# Altium schematic sheet 7М07110 Э3.SchDoc
size 420 x 297 mm; DocumentNumber: 1; SheetNumber: 1; SheetTotal: 11; ListNumber: 1
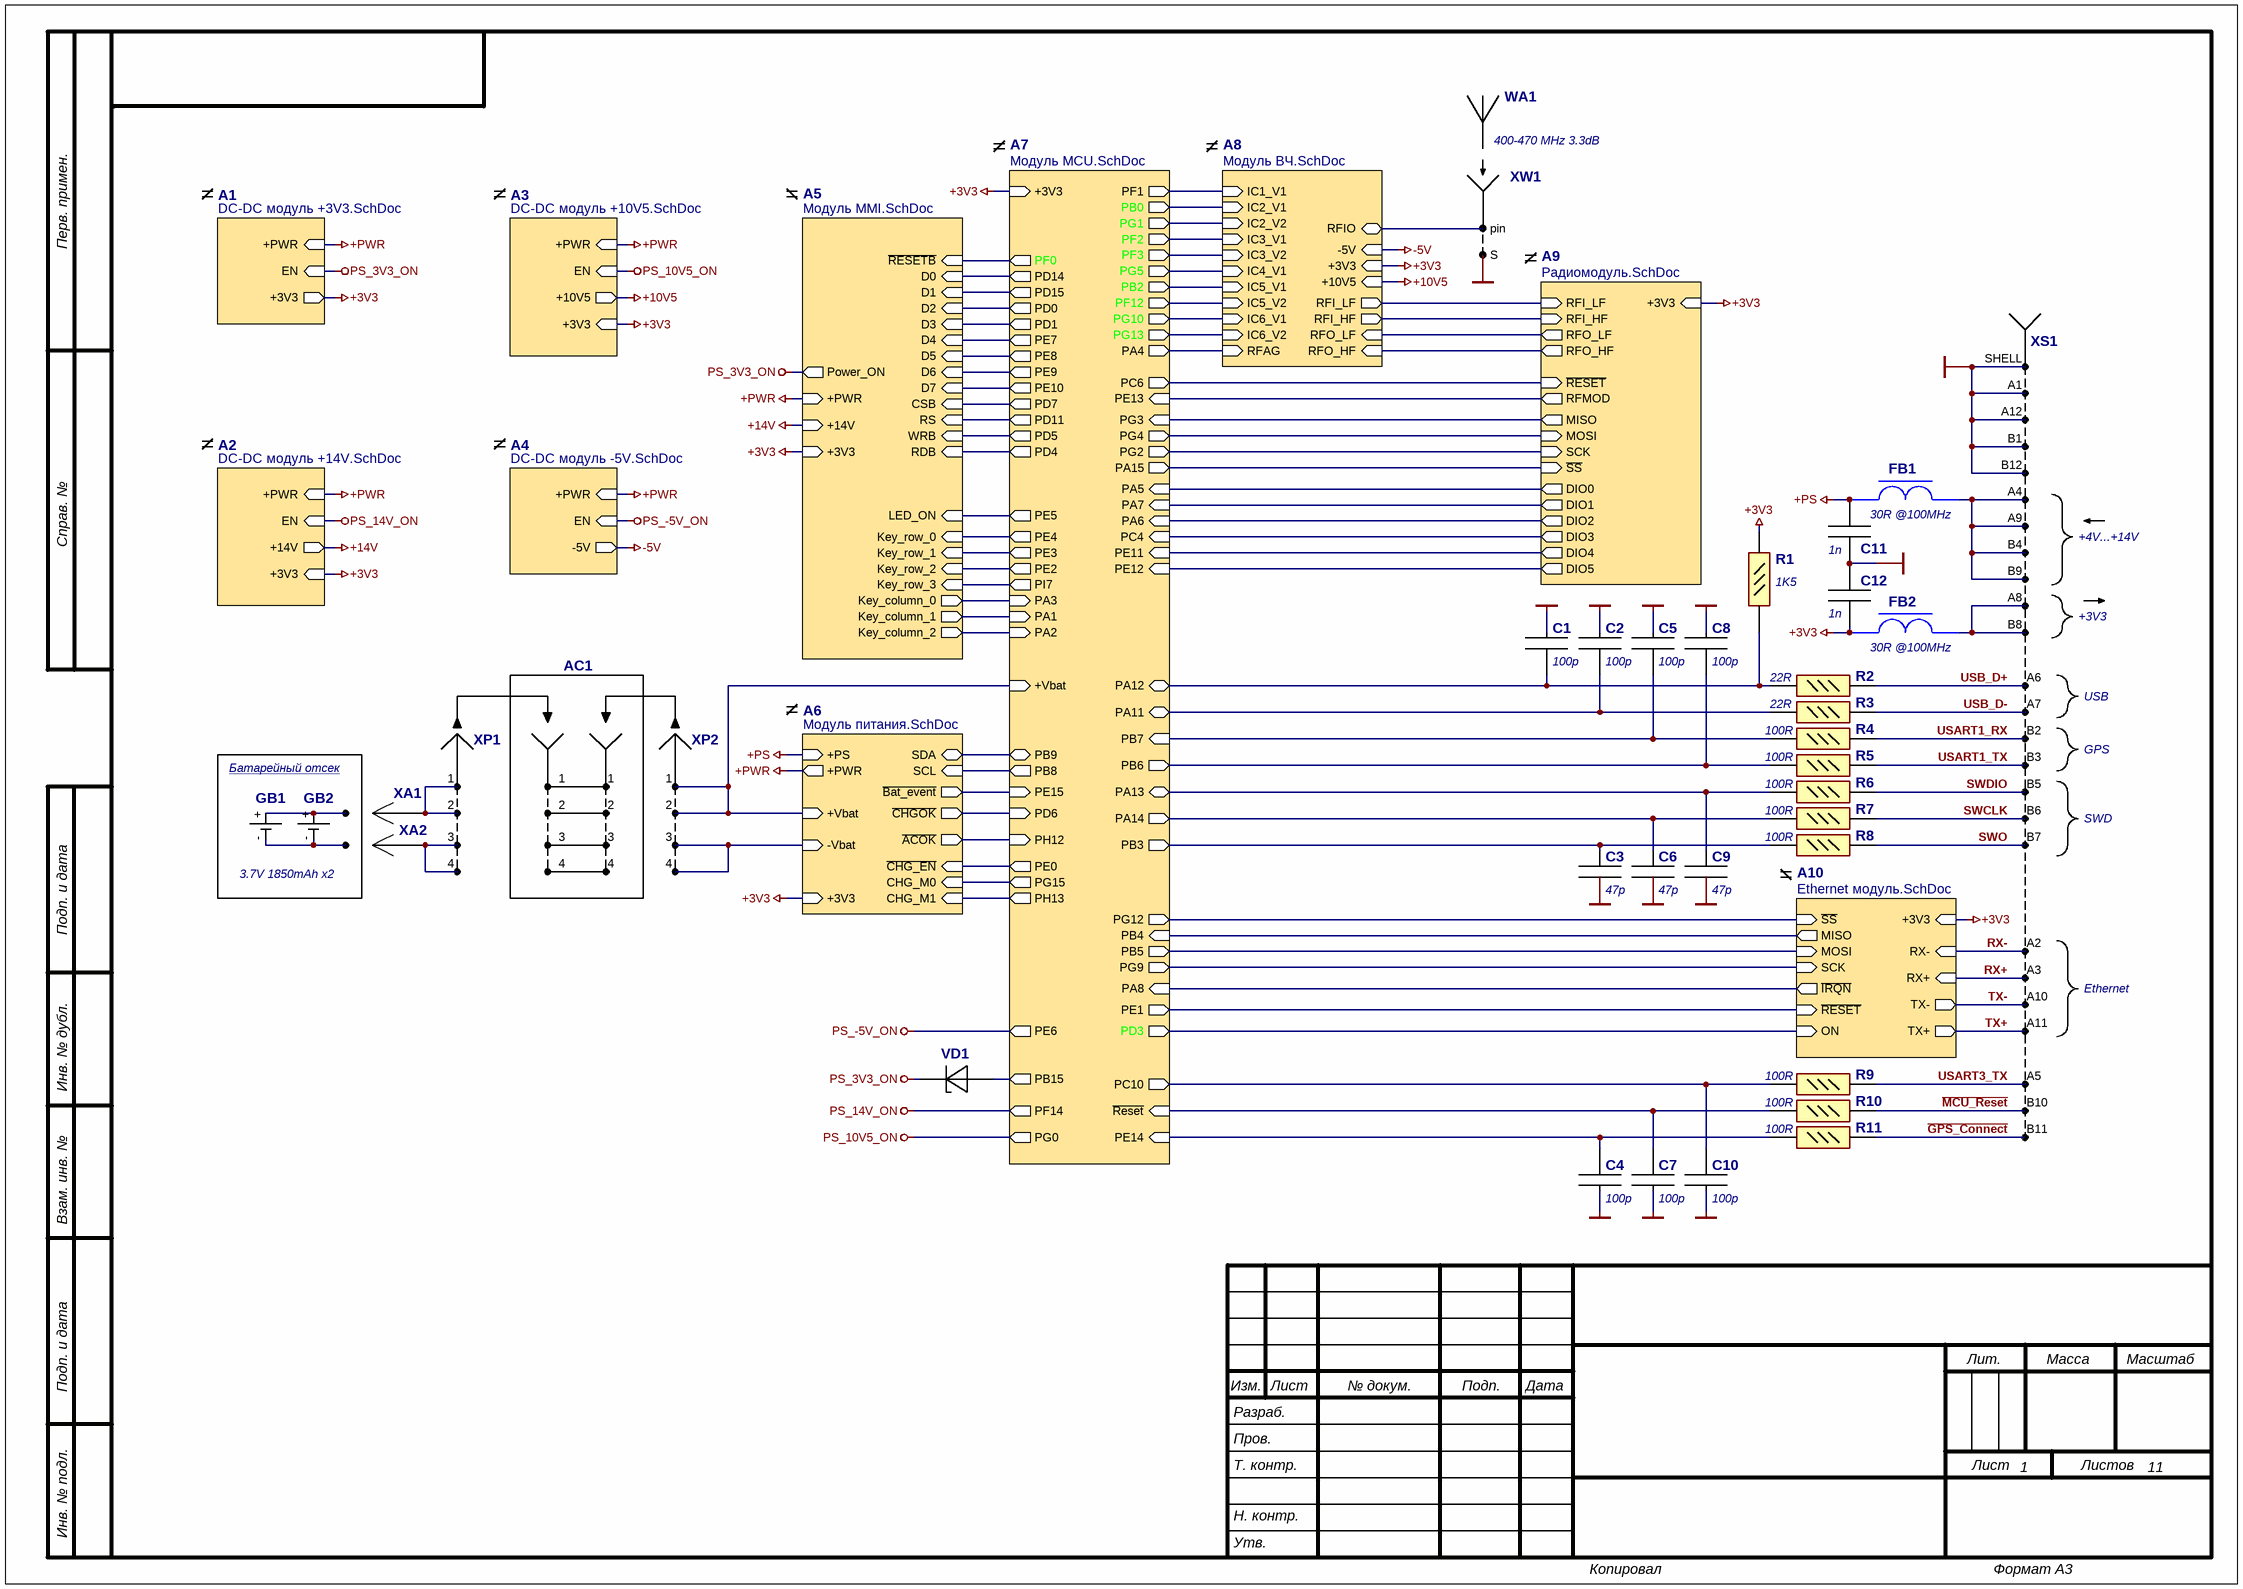
[diagram p0: 7М07110 Э3.SchDoc]

## Parts
AC1  0151320401  (value not drawn)
C1  100p  [:CAP0402 100x50x50]
C2  100p  [:CAP0402 100x50x50]
C3  47p  [:CAP0402 100x50x50]
C4  100p  [:CAP0402 100x50x50]
C5  100p  [:CAP0402 100x50x50]
C6  47p  [:CAP0402 100x50x50]
C7  100p  [:CAP0402 100x50x50]
C8  100p  [:CAP0402 100x50x50]
C9  47p  [:CAP0402 100x50x50]
C10  100p  [:CAP0402 100x50x50]
C11  1n  [:CAP0402 100x50x50]
C12  1n  [:CAP0402 100x50x50]
FB1  30R @100MHz  [:FER BLM18SP300SN1D]
FB2  30R @100MHz  [:FER BLM18SP300SN1D]
GB1  3.7V 1850mAh  (value not drawn)
GB2  3.7V 1850mAh  (value not drawn)
R1  Manufacturer_Part_Number (part 2: value): 1K5  [:RES0402]  (hidden comment: RC0402FR-07)
R2  Manufacturer_Part_Number (part 2: value): 22R  [:RES0402]  (hidden comment: RC0402FR-07)
R3  Manufacturer_Part_Number (part 2: value): 22R  [:RES0402]  (hidden comment: RC0402FR-07)
R4  Manufacturer_Part_Number (part 2: value): 100R  [:RES0402]  (hidden comment: RC0402FR-07)
R5  Manufacturer_Part_Number (part 2: value): 100R  [:RES0402]  (hidden comment: RC0402FR-07)
R6  Manufacturer_Part_Number (part 2: value): 100R  [:RES0402]  (hidden comment: RC0402FR-07)
R7  Manufacturer_Part_Number (part 2: value): 100R  [:RES0402]  (hidden comment: RC0402FR-07)
R8  Manufacturer_Part_Number (part 2: value): 100R  [:RES0402]  (hidden comment: RC0402FR-07)
R9  Manufacturer_Part_Number (part 2: value): 100R  [:RES0402]  (hidden comment: RC0402FR-07)
R10  Manufacturer_Part_Number (part 2: value): 100R  [:RES0402]  (hidden comment: RC0402FR-07)
R11  Manufacturer_Part_Number (part 2: value): 100R  [:RES0402]  (hidden comment: RC0402FR-07)
VD1  30V 0.1A  [:DIODE SOD-923F]  (value not drawn)
WA1  Short Description: 400-470 MHz 3.3dB  (hidden comment: ANT-433-CW-QW-SMA-male)
X1  Big Circle Pad  (value not drawn)
X2  Big Circle Pad  (value not drawn)
XA1  0861-0-15-20-82-14-11-0  (value not drawn)
XA2  0861-0-15-20-82-14-11-0  (value not drawn)
XP1  5040500491  [:CON 5040500491]  (value not drawn)
XP2  5040500491  [:CON 5040500491]  (value not drawn)
XS1  UJ31-CH-3-MSMT-TR-67  [:CON TYPE-C UJ31-CH-3-MSMT-TR-67]  (value not drawn)
XW1  132371  [:CON 132371]  (value not drawn)

## Sub-sheets
A1 = DC-DC модуль +3V3.SchDoc: +3V3 (out), EN (in), +PWR (in)
A2 = DC-DC модуль +14V.SchDoc: +14V (out), EN (in), +PWR (in), +3V3 (in)
A3 = DC-DC модуль +10V5.SchDoc: +10V5 (out), EN (in), +PWR (in), +3V3 (in)
A4 = DC-DC модуль -5V.SchDoc: -5V (out), EN (in), +PWR (in)
A5 = Модуль MMI.SchDoc: D5 (in), D6 (in), D4 (in), D3 (in), CSB (in), RS (in), Key_column_2 (out), LED_ON (in), Power_ON (out), +PWR (in), Key_row_0 (in), Key_row_1 (in), Key_row_2 (in), Key_row_3 (in), Key_column_1 (out), D1 (in), D2 (in), D7 (in), RDB (in), WRB (in), ~{RESETB} (in), Key_column_0 (out), D0 (in), +14V (in), +3V3 (in)
A6 = Модуль питания.SchDoc: +Vbat (in), -Vbat (in), SDA (bidir), SCL (in), +PS (in), +PWR (out), ~{Bat_event} (out), ~{CHGOK} (out), ~{ACOK} (out), ~{CHG_EN} (in), CHG_M0 (in), CHG_M1 (in), +3V3 (in)
A7 = Модуль MCU.SchDoc: +3V3 (in), PF1 (out), PB0 (out), PC6 (out), PA5 (in), PE12 (in), PE11 (in), PA7 (in), PA6 (in), PC4 (in), PE13 (in), PA15 (out), PG2 (out), PG3 (in), PG4 (out), PG1 (out), PG10 (out), PG5 (out), PG13 (out), PB2 (out), PF12 (out), PF3 (out), PF2 (out), PA4 (out), PG12 (out), PB4 (in), PG9 (out), PB5 (out), PA8 (in), PE1 (out), PD3 (out), PE7 (out), PE10 (out), PD7 (out), PD11 (out), PD1 (out), PD5 (out), PE9 (out), PD14 (out), PD0 (out), PE8 (out), PD15 (out), PD4 (out), PE2 (out), PE3 (out), PI7 (out), PE5 (out), PF0 (out), PE4 (out), PA1 (in), PA3 (in), PA2 (in), PA12 (bidir), PA11 (bidir), PB6 (out), PB7 (in), PB3 (out), PA14 (out), PA13 (bidir), PC10 (out), PE14 (in), PE15 (in), PE6 (out), PG0 (out), PF14 (out), PB15 (out), PB9 (bidir), PB8 (out), PD6 (in), PH12 (in), PE0 (out), PG15 (out), PH13 (out), ~{Reset} (in), +Vbat (in)
A8 = Модуль ВЧ.SchDoc: -5V (in), +10V5 (in), IC6_V1 (in), IC4_V1 (in), IC5_V1 (in), IC6_V2 (in), IC2_V1 (in), IC5_V2 (in), IC3_V2 (in), IC3_V1 (in), IC2_V2 (in), RFAG (in), +3V3 (in), RFO_HF (in), RFI_LF (out), RFIO (bidir), RFI_HF (out), RFO_LF (in), IC1_V1 (in)
A9 = Радиомодуль.SchDoc: RFI_LF (in), RFI_HF (in), DIO3 (out), DIO4 (out), DIO5 (out), DIO2 (out), DIO0 (out), DIO1 (out), ~{RESET} (in), +3V3 (in), MISO (out), MOSI (in), RFMOD (out), SCK (in), ~{SS} (in), RFO_HF (out), RFO_LF (out)
A10 = Ethernet модуль.SchDoc: SCK (in), ~{SS} (in), +3V3 (in), ~{IRQN} (out), RX- (in), MISO (out), ON (in), RX+ (in), MOSI (in), TX- (out), ~{RESET} (in), TX+ (out)

## Nets
+3V3: C12.2 FB2.1 R1.2 ; sheet A1/+3V3, sheet A2/+3V3, sheet A10/+3V3, sheet A7/+3V3, sheet A5/+3V3, sheet A9/+3V3, sheet A8/+3V3, sheet A6/+3V3, sheet A3/+3V3
+10V5: sheet A8/+10V5, sheet A3/+10V5
+14V: sheet A2/+14V, sheet A5/+14V
+PS: C11.1 FB1.1 ; sheet A6/+PS
+PWR: sheet A1/+PWR, sheet A2/+PWR, sheet A4/+PWR, sheet A5/+PWR, sheet A6/+PWR, sheet A3/+PWR
-5V: sheet A4/-5V, sheet A8/-5V
GND: C1.2 C2.2 C3.2 C4.2 C5.2 C6.2 C7.2 C8.2 C9.2 C10.2 C11.2 C12.1 XS1.A1(GND_1) XS1.A12(GND_2) XS1.B1(GND_3) XS1.B12(GND_4) XS1.SHELL XW1.2(S)
PS_3V3_ON: VD1.1(K) ; sheet A1/EN, sheet A5/Power_ON
PS_10V5_ON: sheet A7/PG0, sheet A3/EN
PS_14V_ON: sheet A2/EN, sheet A7/PF14
PS_-5V_ON: sheet A4/EN, sheet A7/PE6
~{GPS_Connect}: R11.2 XS1.B11(SSRXP1)
~{MCU_Reset}: R10.2 XS1.B10(SSRXN1)
RX+: XS1.A3(SSTXN1) ; sheet A10/RX+
RX-: XS1.A2(SSTXP1) ; sheet A10/RX-
SWCLK: R7.2 XS1.B6(DP2)
SWDIO: R6.2 XS1.B5(CC2)
SWO: R8.2 XS1.B7(DN2)
TX+: XS1.A11(SSRXP2) ; sheet A10/TX+
TX-: XS1.A10(SSRXN2) ; sheet A10/TX-
USART1_RX: R4.2 XS1.B2(SSTXP2)
USART1_TX: R5.2 XS1.B3(SSTXN2)
USART3_TX: R9.2 XS1.A5(CC1)
USB_D+: R2.2 XS1.A6(DP1)
USB_D-: R3.2 XS1.A7(DN1)
NetC1_1: C1.1 R1.1 R2.1 ; sheet A7/PA12
NetC2_1: C2.1 R3.1 ; sheet A7/PA11
NetC3_1: C3.1 R8.1 ; sheet A7/PB3
NetC4_1: C4.1 R11.1 ; sheet A7/PE14
NetC5_1: C5.1 R4.1 ; sheet A7/PB7
NetC6_1: C6.1 R7.1 ; sheet A7/PA14
NetC7_1: C7.1 R10.1 ; sheet A7/~{Reset}
NetC8_1: C8.1 R5.1 ; sheet A7/PB6
NetC9_1: C9.1 R6.1 ; sheet A7/PA13
NetC10_1: C10.1 R9.1 ; sheet A7/PC10
NetFB1_2: FB1.2 XS1.A4(VBUS_1) XS1.A9(VBUS_2) XS1.B4(VBUS_3) XS1.B9(VBUS_4)
NetFB2_2: FB2.2 XS1.A8(SBU1) XS1.B8(SBU2)
NetGB1_+: GB1.+(red) GB2.+(red) X1.1
NetGB1_-: GB1.-(black) GB2.-(black) X2.1
NetVD1_2: VD1.2(A) ; sheet A7/PB15
NetXA1_1: XA1.1 XP1.1 XP1.2
NetXA2_1: XA2.1 XP1.3 XP1.4
NetXP2_1: XP2.1 XP2.2 ; sheet A7/+Vbat, sheet A6/+Vbat
NetXP2_3: XP2.3 XP2.4 ; sheet A6/-Vbat
NetXW1_1: XW1.1(pin) ; sheet A8/RFIO
(unnamed): sheet A10/SCK, sheet A7/PG9
(unnamed): sheet A10/~{SS}, sheet A7/PG12
(unnamed): sheet A10/~{IRQN}, sheet A7/PA8
(unnamed): sheet A10/MISO, sheet A7/PB4
(unnamed): sheet A10/ON, sheet A7/PD3
(unnamed): sheet A10/MOSI, sheet A7/PB5
(unnamed): sheet A10/~{RESET}, sheet A7/PE1
(unnamed): sheet A7/PF1, sheet A8/IC1_V1
(unnamed): sheet A7/PB0, sheet A8/IC2_V1
(unnamed): sheet A7/PC6, sheet A9/~{RESET}
(unnamed): sheet A7/PA5, sheet A9/DIO0
(unnamed): sheet A7/PE12, sheet A9/DIO5
(unnamed): sheet A7/PE11, sheet A9/DIO4
(unnamed): sheet A7/PA7, sheet A9/DIO1
(unnamed): sheet A7/PA6, sheet A9/DIO2
(unnamed): sheet A7/PC4, sheet A9/DIO3
(unnamed): sheet A7/PE13, sheet A9/RFMOD
(unnamed): sheet A7/PA15, sheet A9/~{SS}
(unnamed): sheet A7/PG2, sheet A9/SCK
(unnamed): sheet A7/PG3, sheet A9/MISO
(unnamed): sheet A7/PG4, sheet A9/MOSI
(unnamed): sheet A7/PG1, sheet A8/IC2_V2
(unnamed): sheet A7/PG10, sheet A8/IC6_V1
(unnamed): sheet A7/PG5, sheet A8/IC4_V1
(unnamed): sheet A7/PG13, sheet A8/IC6_V2
(unnamed): sheet A7/PB2, sheet A8/IC5_V1
(unnamed): sheet A7/PF12, sheet A8/IC5_V2
(unnamed): sheet A7/PF3, sheet A8/IC3_V2
(unnamed): sheet A7/PF2, sheet A8/IC3_V1
(unnamed): sheet A7/PA4, sheet A8/RFAG
(unnamed): sheet A7/PE7, sheet A5/D4
(unnamed): sheet A7/PE10, sheet A5/D7
(unnamed): sheet A7/PD7, sheet A5/CSB
(unnamed): sheet A7/PD11, sheet A5/RS
(unnamed): sheet A7/PD1, sheet A5/D3
(unnamed): sheet A7/PD5, sheet A5/WRB
(unnamed): sheet A7/PE9, sheet A5/D6
(unnamed): sheet A7/PD14, sheet A5/D0
(unnamed): sheet A7/PD0, sheet A5/D2
(unnamed): sheet A7/PE8, sheet A5/D5
(unnamed): sheet A7/PD15, sheet A5/D1
(unnamed): sheet A7/PD4, sheet A5/RDB
(unnamed): sheet A7/PE2, sheet A5/Key_row_2
(unnamed): sheet A7/PE3, sheet A5/Key_row_1
(unnamed): sheet A7/PI7, sheet A5/Key_row_3
(unnamed): sheet A7/PE5, sheet A5/LED_ON
(unnamed): sheet A7/PF0, sheet A5/~{RESETB}
(unnamed): sheet A7/PE4, sheet A5/Key_row_0
(unnamed): sheet A7/PA1, sheet A5/Key_column_1
(unnamed): sheet A7/PA3, sheet A5/Key_column_0
(unnamed): sheet A7/PA2, sheet A5/Key_column_2
(unnamed): sheet A7/PE15, sheet A6/~{Bat_event}
(unnamed): sheet A7/PB9, sheet A6/SDA
(unnamed): sheet A7/PB8, sheet A6/SCL
(unnamed): sheet A7/PD6, sheet A6/~{CHGOK}
(unnamed): sheet A7/PH12, sheet A6/~{ACOK}
(unnamed): sheet A7/PE0, sheet A6/~{CHG_EN}
(unnamed): sheet A7/PG15, sheet A6/CHG_M0
(unnamed): sheet A7/PH13, sheet A6/CHG_M1
(unnamed): sheet A9/RFI_LF, sheet A8/RFI_LF
(unnamed): sheet A9/RFI_HF, sheet A8/RFI_HF
(unnamed): sheet A9/RFO_HF, sheet A8/RFO_HF
(unnamed): sheet A9/RFO_LF, sheet A8/RFO_LF

Not connected (* = marked no-connect by the designer): AC1 1 2 3 4

## Notes on the sheet
- (near XS1) +4V...+14V
- (near XS1) +3V3
- USB
- Батарейный отсек
- (near AC1) 1
- GPS
- (near AC1) 2
- (near AC1) 3
- (near AC1) 4
- SWD
- 3.7V 1850mAh х2
- Ethernet
- Перв. примен.
- Справ. №
- Подп. и дата
- Инв. № дубл.
- Взам. инв. №
- Изм.
- Лист
- № докум.
- Подп.
- Дата
- Лит.
- Масса
- Масштаб
- Разраб.
- Пров.
- Т. контр.
- Листов
- Инв. № подл.
- Н. контр.
- Утв.
- Копировал
- Формат А3

## Library data of the parts
AC1 = 0151320401: Cable-Assy Picolock 1.5mm Pitch 4 Wire 24AWG 100mm; Manufacturer_Name: Molex; Manufacturer_Part_Number: 0151320401; Short Description: 4 Wire 24AWG
C1 C2 C4 C5 C7 C8 C10 = GCM1555C1H101JA16D: CAP CER  50V C0G/NP0 0402; Manufacturer_Name: Murata Electronics; Short Description: 0402 100p 50V; Manufacturer_Part_Number: GCM1555C1H101JA16D
C3 C6 C9 = GJM1555C1H470GB01D: CAP CER  50V C0G/NP0 0402; Manufacturer_Name: Murata Electronics; Short Description: 0402 47p 50V; Manufacturer_Part_Number: GJM1555C1H470GB01D
C11 C12 = GRM1555C1H102JA01J: ±5% 50V Ceramic Capacitor C0G, NP0 0402 (1005 Metric); Manufacturer_Name: Murata Electronics; Short Description: 0402 1n 50V; Height: 0.55mm; Manufacturer_Part_Number: GRM1555C1H102JA01J
FB1 FB2 = BLM18SP300SN1D: 30 Ohms @ 100MHz 1 Power Line Ferrite Bead 0603 (1608 Metric) 6A 8mOhm; Manufacturer_Name: Murata Electronics; Short Description: 0603 30R @100MHz; Datasheet Link: http://www.murata.com/~/media/webrenewal/support/library/catalog/products/emc/emifil/c31e.ashx?la=en-gb; Height: 0.95mm; Manufacturer_Part_Number: BLM18SP300SN1D; Mouser Part Number: 81-BLM18SP300SN1D; Mouser Price/Stock: https://www.mouser.co.uk/ProductDetail/Murata-Electronics/BLM18SP300SN1D/?qs=W%2FMpXkg%252BdQ4o%252BOP%252B6m8FYA%3D%3D
GB1 GB2 = LP-1850-103450UN: Battery Li-po 3.7V 1850mAh 10х34х50; Manufacturer_Name: ROBITON; Short Description: Li-pol  1850мАч; Manufacturer_Part_Number: LP-1850-103450UN
R1-R11 = RC0402FR-07: Resistor 0402 1% 1/16W / Value Range: 1Ω ... 10 MΩ / Value Example: / 0R = 0Ω / 97R6 = 97.6Ω / 9K76 = 9760Ω / 1M = 1,000,000Ω; Manufacturer_Name: YAGEO; Manufacturer_Part_Number (part 3: after value): L; Short Description: 0402 1%; Datasheet Link: http://www.yageo.com/documents/recent/PYu-RC0402_51_RoHS_L_6_r.pdf; Height: 0.4mm; Manufacturer_Part_Number: RC0402FR-07; Parameter 1: *
VD1 = CDBQR0130R: Diodes Schottky 0402 30V 0.1A; Manufacturer_Name: Comchip Technology; Datasheet Link: http://www.comchiptech.com/admin/files/product/CDBQR0130R-HF-RevC796140.pdf; Height: 0.55mm; Manufacturer_Part_Number: CDBQR0130R; Mouser Part Number: 750-CDBQR0130R; Mouser Price/Stock: https://www.mouser.co.uk/ProductDetail/Comchip-Technology/CDBQR0130R?qs=tw%252BuQ%2FB6PO3SSBtQ52w%2FCg%3D%3D; Arrow Part Number: CDBQR0130R; Arrow Price/Stock: https://www.arrow.com/en/products/cdbqr0130r/comchip-technology; Short Description: 0402 30V 0.1A
WA1 = ANT-433-CW-QW-SMA-male: Antenna 400-470MHz 3.3dB SMA male; Manufacturer_Name: AntennaFactor by Linx; Manufacturer_Part_Number: ANT-433-CW-QW-SMA-male
X1 X2 = Big Circle Pad: Большая круглая контактная площадка
XA1 XA2 = 0861-0-15-20-82-14-11-0: Контакт пружинный 9A 10mm; Manufacturer_Name: MILL-MAX; Short Description: 9A 10mm; Manufacturer_Part_Number: 0861-0-15-20-82-14-11-0
XP1 XP2 = 5040500491: Picolock 1.5mm Pitch Male 4-pin; Manufacturer_Name: Molex; Short Description: 1.5mm 4-pin; Manufacturer_Part_Number: 5040500491
XS1 = UJ31-CH-3-MSMT-TR-67: type C IP67 with ruber O ring; Manufacturer_Name: CUI Devices; Manufacturer_Part_Number: UJ31-CH-3-MSMT-TR-67; Short Description: type C IP67
XW1 = 132371: RF SMA Connectors 50Ohm; Manufacturer_Name: Amphenol; Short Description: SMA 50Ohm; Manufacturer_Part_Number: 132371